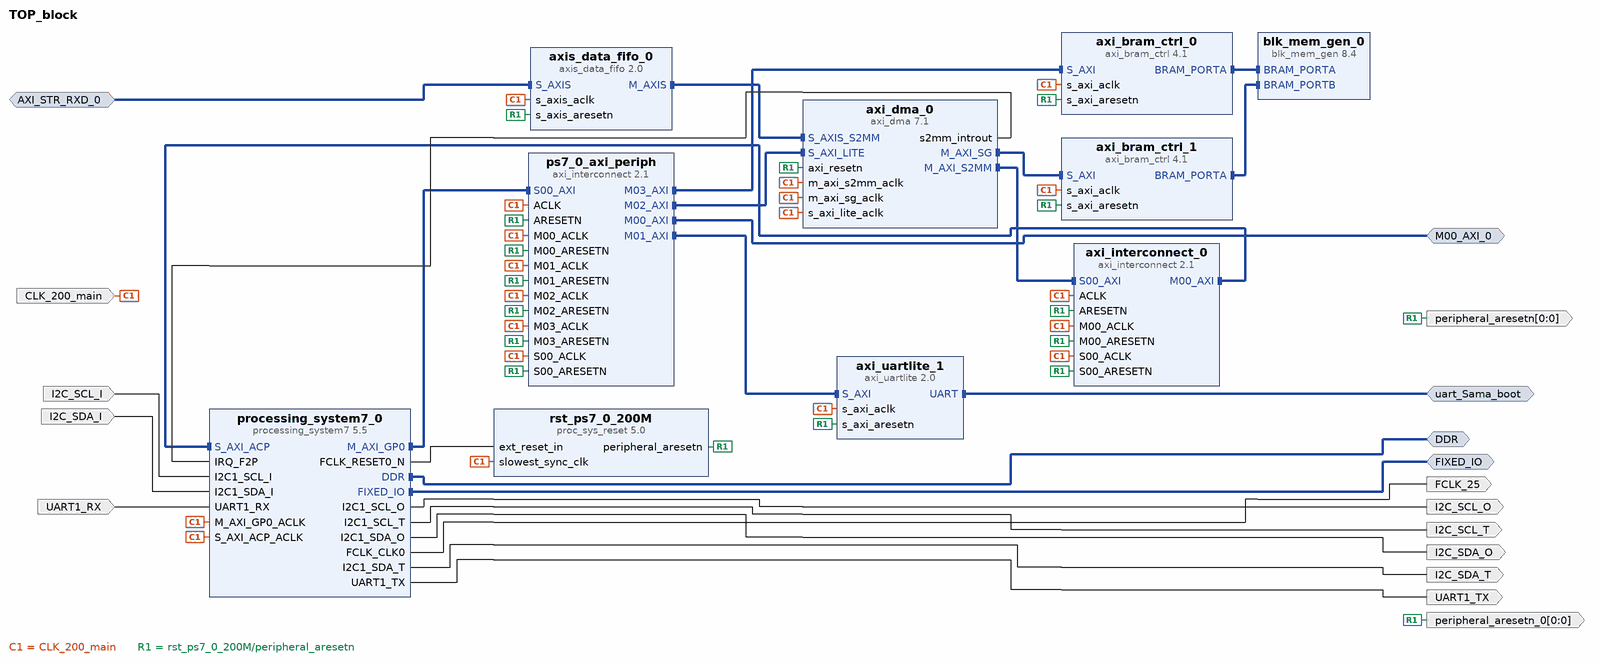
[diagram p0: block diagram of the top level]
# Vivado block design TOP_block, xc7z014sclg484-2, Vivado 2019.2
create_bd_design TOP_block

create_bd_intf_port -mode Master -vlnv xilinx.com:interface:ddrx_rtl:1.0 DDR
create_bd_intf_port -mode Master -vlnv xilinx.com:display_processing_system7:fixedio_rtl:1.0 FIXED_IO
create_bd_intf_port -mode Slave -vlnv xilinx.com:interface:axis_rtl:1.0 AXI_STR_RXD_0
set_property -dict [list \
  CONFIG.TDATA_NUM_BYTES 4 \
  CONFIG.TDEST_WIDTH 0 \
  CONFIG.TID_WIDTH 0 \
  CONFIG.TUSER_WIDTH 0 \
  CONFIG.HAS_TREADY 1 \
  CONFIG.HAS_TSTRB 0 \
  CONFIG.HAS_TKEEP 0 \
  CONFIG.HAS_TLAST 1 \
  CONFIG.FREQ_HZ 200000000 \
  CONFIG.LAYERED_METADATA undef \
] [get_bd_intf_ports AXI_STR_RXD_0]
create_bd_intf_port -mode Master -vlnv xilinx.com:interface:uart_rtl:1.0 uart_Sama_boot
create_bd_intf_port -mode Master -vlnv xilinx.com:interface:aximm_rtl:1.0 M00_AXI_0
set_property -dict [list \
  CONFIG.DATA_WIDTH 32 \
  CONFIG.PROTOCOL AXI4LITE \
  CONFIG.FREQ_HZ 200000000 \
  CONFIG.ADDR_WIDTH 32 \
  CONFIG.HAS_BURST 0 \
  CONFIG.HAS_LOCK 0 \
  CONFIG.HAS_CACHE 0 \
  CONFIG.HAS_QOS 0 \
  CONFIG.HAS_REGION 0 \
  CONFIG.NUM_READ_OUTSTANDING 2 \
  CONFIG.NUM_WRITE_OUTSTANDING 2 \
] [get_bd_intf_ports M00_AXI_0]
create_bd_port -dir O UART1_TX
create_bd_port -dir I UART1_RX
create_bd_port -dir I I2C_SDA_I
create_bd_port -dir O I2C_SDA_O
create_bd_port -dir O I2C_SDA_T
create_bd_port -dir I I2C_SCL_I
create_bd_port -dir O I2C_SCL_O
create_bd_port -dir O I2C_SCL_T
create_bd_port -dir O -type clk FCLK_25
set_property -dict {CONFIG.FREQ_HZ 25000000} [get_bd_ports FCLK_25]
create_bd_port -dir I -type clk CLK_200_main
set_property -dict {CONFIG.FREQ_HZ 200000000} [get_bd_ports CLK_200_main]
create_bd_port -dir O -from 0 -to 0 -type rst peripheral_aresetn
create_bd_port -dir O -from 0 -to 0 -type rst peripheral_aresetn_0

create_bd_cell -type ip -vlnv xilinx.com:ip:axi_bram_ctrl:4.1 axi_bram_ctrl_0
set_property -dict {CONFIG.PROTOCOL AXI4 CONFIG.SINGLE_PORT_BRAM 1} [get_bd_cells axi_bram_ctrl_0]
create_bd_cell -type ip -vlnv xilinx.com:ip:axi_bram_ctrl:4.1 axi_bram_ctrl_1
set_property -dict {CONFIG.PROTOCOL AXI4 CONFIG.SINGLE_PORT_BRAM 1} [get_bd_cells axi_bram_ctrl_1]
create_bd_cell -type ip -vlnv xilinx.com:ip:axi_dma:7.1 axi_dma_0
set_property -dict [list \
  CONFIG.c_include_mm2s 0 \
  CONFIG.c_include_s2mm 1 \
  CONFIG.c_include_sg 1 \
  CONFIG.c_s2mm_burst_size 256 \
  CONFIG.c_sg_include_stscntrl_strm 0 \
  CONFIG.c_sg_length_width 24 \
] [get_bd_cells axi_dma_0]
create_bd_cell -type ip -vlnv xilinx.com:ip:axi_interconnect:2.1 axi_interconnect_0
set_property -dict {CONFIG.NUM_MI 1 CONFIG.NUM_SI 1} [get_bd_cells axi_interconnect_0]
create_bd_cell -type ip -vlnv xilinx.com:ip:axi_uartlite:2.0 axi_uartlite_1
set_property -dict {CONFIG.C_BAUDRATE 115200 CONFIG.C_S_AXI_ACLK_FREQ_HZ 200000000} [get_bd_cells axi_uartlite_1]
create_bd_cell -type ip -vlnv xilinx.com:ip:axis_data_fifo:2.0 axis_data_fifo_0
set_property -dict {CONFIG.FIFO_DEPTH 16384 CONFIG.FIFO_MODE 2 CONFIG.IS_ACLK_ASYNC 0} [get_bd_cells axis_data_fifo_0]
create_bd_cell -type ip -vlnv xilinx.com:ip:blk_mem_gen:8.4 blk_mem_gen_0
set_property -dict [list \
  CONFIG.EN_SAFETY_CKT false \
  CONFIG.Enable_B Use_ENB_Pin \
  CONFIG.Memory_Type True_Dual_Port_RAM \
  CONFIG.Port_B_Clock 100 \
  CONFIG.Port_B_Enable_Rate 100 \
  CONFIG.Port_B_Write_Rate 50 \
  CONFIG.Use_RSTB_Pin true \
] [get_bd_cells blk_mem_gen_0]
create_bd_cell -type ip -vlnv xilinx.com:ip:processing_system7:5.5 processing_system7_0
set_property -dict [list \
  CONFIG.PCW_APU_PERIPHERAL_FREQMHZ 650 \
  CONFIG.PCW_CPU_CPU_6X4X_MAX_RANGE 767 \
  CONFIG.PCW_CRYSTAL_PERIPHERAL_FREQMHZ 50 \
  CONFIG.PCW_ENET0_ENET0_IO {MIO 16 .. 27} \
  CONFIG.PCW_ENET0_GRP_MDIO_ENABLE 1 \
  CONFIG.PCW_ENET0_GRP_MDIO_IO {MIO 52 .. 53} \
  CONFIG.PCW_ENET0_PERIPHERAL_ENABLE 1 \
  CONFIG.PCW_FPGA0_PERIPHERAL_FREQMHZ 25 \
  CONFIG.PCW_FPGA1_PERIPHERAL_FREQMHZ 50 \
  CONFIG.PCW_FPGA2_PERIPHERAL_FREQMHZ 25 \
  CONFIG.PCW_GPIO_MIO_GPIO_ENABLE 0 \
  CONFIG.PCW_I2C0_GRP_INT_ENABLE 0 \
  CONFIG.PCW_I2C0_I2C0_IO {MIO 50 .. 51} \
  CONFIG.PCW_I2C0_PERIPHERAL_ENABLE 1 \
  CONFIG.PCW_I2C1_I2C1_IO EMIO \
  CONFIG.PCW_I2C1_PERIPHERAL_ENABLE 1 \
  CONFIG.PCW_I2C_PERIPHERAL_FREQMHZ 108.333336 \
  CONFIG.PCW_IRQ_F2P_INTR 1 \
  CONFIG.PCW_PERIPHERAL_BOARD_PRESET part0 \
  CONFIG.PCW_PRESET_BANK1_VOLTAGE {LVCMOS 1.8V} \
  CONFIG.PCW_QSPI_GRP_SINGLE_SS_ENABLE 1 \
  CONFIG.PCW_QSPI_GRP_SINGLE_SS_IO {MIO 1 .. 6} \
  CONFIG.PCW_QSPI_PERIPHERAL_ENABLE 1 \
  CONFIG.PCW_QSPI_QSPI_IO {MIO 1 .. 6} \
  CONFIG.PCW_SD0_PERIPHERAL_ENABLE 0 \
  CONFIG.PCW_SD1_PERIPHERAL_ENABLE 1 \
  CONFIG.PCW_SD1_SD1_IO {MIO 10 .. 15} \
  CONFIG.PCW_SDIO_PERIPHERAL_FREQMHZ 100 \
  CONFIG.PCW_SINGLE_QSPI_DATA_MODE x4 \
  CONFIG.PCW_UART0_PERIPHERAL_ENABLE 1 \
  CONFIG.PCW_UART0_UART0_IO {MIO 46 .. 47} \
  CONFIG.PCW_UART1_PERIPHERAL_ENABLE 1 \
  CONFIG.PCW_UART1_UART1_IO EMIO \
  CONFIG.PCW_UART_PERIPHERAL_FREQMHZ 100 \
  CONFIG.PCW_UIPARAM_DDR_BUS_WIDTH {16 Bit} \
  CONFIG.PCW_UIPARAM_DDR_FREQ_MHZ 400 \
  CONFIG.PCW_UIPARAM_DDR_MEMORY_TYPE {DDR 3 (Low Voltage)} \
  CONFIG.PCW_UIPARAM_DDR_PARTNO {MT41K256M16 RE-125} \
  CONFIG.PCW_USB0_PERIPHERAL_ENABLE 0 \
  CONFIG.PCW_USE_FABRIC_INTERRUPT 1 \
  CONFIG.PCW_USE_S_AXI_ACP 1 \
] [get_bd_cells processing_system7_0]
# 440 more settings of processing_system7_0 are not shown: defaults, MIO pin electricals, DDR timing, and values the tool derives
create_bd_cell -type ip -vlnv xilinx.com:ip:axi_interconnect:2.1 ps7_0_axi_periph
set_property -dict {CONFIG.NUM_MI 4} [get_bd_cells ps7_0_axi_periph]
create_bd_cell -type ip -vlnv xilinx.com:ip:proc_sys_reset:5.0 rst_ps7_0_200M
set_property -dict {CONFIG.C_NUM_PERP_RST 1} [get_bd_cells rst_ps7_0_200M]

# ---- connections ----

connect_bd_intf_net [get_bd_intf_ports DDR] [get_bd_intf_pins processing_system7_0/DDR]
connect_bd_intf_net [get_bd_intf_pins axi_bram_ctrl_0/BRAM_PORTA] [get_bd_intf_pins blk_mem_gen_0/BRAM_PORTA]
connect_bd_intf_net [get_bd_intf_pins axi_dma_0/M_AXI_SG] [get_bd_intf_pins axi_bram_ctrl_1/S_AXI]
connect_bd_intf_net [get_bd_intf_ports M00_AXI_0] [get_bd_intf_pins ps7_0_axi_periph/M00_AXI]
connect_bd_intf_net [get_bd_intf_pins axi_interconnect_0/M00_AXI] [get_bd_intf_pins processing_system7_0/S_AXI_ACP]
connect_bd_intf_net [get_bd_intf_pins axi_dma_0/M_AXI_S2MM] [get_bd_intf_pins axi_interconnect_0/S00_AXI]
connect_bd_intf_net [get_bd_intf_ports uart_Sama_boot] [get_bd_intf_pins axi_uartlite_1/UART]
connect_bd_intf_net -intf_net AXI_STR_RXD_0_1 [get_bd_intf_ports AXI_STR_RXD_0] [get_bd_intf_pins axis_data_fifo_0/S_AXIS]
connect_bd_intf_net [get_bd_intf_pins ps7_0_axi_periph/M03_AXI] [get_bd_intf_pins axi_bram_ctrl_0/S_AXI]
connect_bd_intf_net [get_bd_intf_ports FIXED_IO] [get_bd_intf_pins processing_system7_0/FIXED_IO]
connect_bd_intf_net [get_bd_intf_pins ps7_0_axi_periph/M02_AXI] [get_bd_intf_pins axi_dma_0/S_AXI_LITE]
connect_bd_intf_net [get_bd_intf_pins axis_data_fifo_0/M_AXIS] [get_bd_intf_pins axi_dma_0/S_AXIS_S2MM]
connect_bd_intf_net [get_bd_intf_pins processing_system7_0/M_AXI_GP0] [get_bd_intf_pins ps7_0_axi_periph/S00_AXI]
connect_bd_intf_net [get_bd_intf_pins blk_mem_gen_0/BRAM_PORTB] [get_bd_intf_pins axi_bram_ctrl_1/BRAM_PORTA]
connect_bd_intf_net [get_bd_intf_pins ps7_0_axi_periph/M01_AXI] [get_bd_intf_pins axi_uartlite_1/S_AXI]
connect_bd_net [get_bd_ports CLK_200_main] \
  [get_bd_pins axi_bram_ctrl_0/s_axi_aclk] [get_bd_pins axi_bram_ctrl_1/s_axi_aclk] [get_bd_pins axi_dma_0/s_axi_lite_aclk] \
  [get_bd_pins axi_dma_0/m_axi_sg_aclk] [get_bd_pins axi_dma_0/m_axi_s2mm_aclk] [get_bd_pins axi_interconnect_0/ACLK] \
  [get_bd_pins axi_interconnect_0/S00_ACLK] [get_bd_pins axi_interconnect_0/M00_ACLK] [get_bd_pins axi_uartlite_1/s_axi_aclk] \
  [get_bd_pins axis_data_fifo_0/s_axis_aclk] [get_bd_pins processing_system7_0/M_AXI_GP0_ACLK] \
  [get_bd_pins processing_system7_0/S_AXI_ACP_ACLK] [get_bd_pins ps7_0_axi_periph/ACLK] \
  [get_bd_pins ps7_0_axi_periph/S00_ACLK] [get_bd_pins ps7_0_axi_periph/M00_ACLK] [get_bd_pins ps7_0_axi_periph/M01_ACLK] \
  [get_bd_pins ps7_0_axi_periph/M02_ACLK] [get_bd_pins ps7_0_axi_periph/M03_ACLK] \
  [get_bd_pins rst_ps7_0_200M/slowest_sync_clk]
connect_bd_net [get_bd_ports I2C_SCL_I] [get_bd_pins processing_system7_0/I2C1_SCL_I]
connect_bd_net [get_bd_ports I2C_SDA_I] [get_bd_pins processing_system7_0/I2C1_SDA_I]
connect_bd_net [get_bd_ports UART1_RX] [get_bd_pins processing_system7_0/UART1_RX]
connect_bd_net [get_bd_pins axi_dma_0/s2mm_introut] [get_bd_pins processing_system7_0/IRQ_F2P]
connect_bd_net [get_bd_pins processing_system7_0/FCLK_RESET0_N] [get_bd_pins rst_ps7_0_200M/ext_reset_in]
connect_bd_net [get_bd_pins processing_system7_0/I2C1_SCL_O] [get_bd_ports I2C_SCL_O]
connect_bd_net [get_bd_pins processing_system7_0/I2C1_SCL_T] [get_bd_ports I2C_SCL_T]
connect_bd_net [get_bd_pins processing_system7_0/I2C1_SDA_O] [get_bd_ports I2C_SDA_O]
connect_bd_net [get_bd_pins processing_system7_0/I2C1_SDA_T] [get_bd_ports I2C_SDA_T]
connect_bd_net [get_bd_pins processing_system7_0/UART1_TX] [get_bd_ports UART1_TX]
connect_bd_net [get_bd_pins rst_ps7_0_200M/peripheral_aresetn] \
  [get_bd_ports peripheral_aresetn_0] [get_bd_ports peripheral_aresetn] [get_bd_pins axi_bram_ctrl_0/s_axi_aresetn] \
  [get_bd_pins axi_bram_ctrl_1/s_axi_aresetn] [get_bd_pins axi_dma_0/axi_resetn] [get_bd_pins axi_interconnect_0/ARESETN] \
  [get_bd_pins axi_interconnect_0/S00_ARESETN] [get_bd_pins axi_interconnect_0/M00_ARESETN] \
  [get_bd_pins axi_uartlite_1/s_axi_aresetn] [get_bd_pins axis_data_fifo_0/s_axis_aresetn] \
  [get_bd_pins ps7_0_axi_periph/ARESETN] [get_bd_pins ps7_0_axi_periph/S00_ARESETN] \
  [get_bd_pins ps7_0_axi_periph/M00_ARESETN] [get_bd_pins ps7_0_axi_periph/M01_ARESETN] \
  [get_bd_pins ps7_0_axi_periph/M02_ARESETN] [get_bd_pins ps7_0_axi_periph/M03_ARESETN]
connect_bd_net [get_bd_pins processing_system7_0/FCLK_CLK0] [get_bd_ports FCLK_25]
set_property HDL_ATTRIBUTE.BMM_INFO_ADDRESS_SPACE {byte  0x40000000 32 > TOP_block blk_mem_gen_0} [get_bd_cells axi_bram_ctrl_0]
set_property HDL_ATTRIBUTE.KEEP_HIERARCHY yes [get_bd_cells axi_bram_ctrl_0]
set_property HDL_ATTRIBUTE.BMM_INFO_PROCESSOR {arm > TOP_block axi_bram_ctrl_0} [get_bd_cells processing_system7_0]
set_property HDL_ATTRIBUTE.KEEP_HIERARCHY yes [get_bd_cells processing_system7_0]

# ---- address map ----
assign_bd_address -offset 0x00000000 -range 512M -target_address_space [get_bd_addr_spaces axi_dma_0/Data_S2MM] [get_bd_addr_segs processing_system7_0/S_AXI_ACP/ACP_DDR_LOWOCM]
assign_bd_address -offset 0xFC000000 -range 16M -target_address_space [get_bd_addr_spaces axi_dma_0/Data_S2MM] [get_bd_addr_segs processing_system7_0/S_AXI_ACP/ACP_QSPI_LINEAR]
assign_bd_address -offset 0x40000000 -range 8K -target_address_space [get_bd_addr_spaces axi_dma_0/Data_SG] [get_bd_addr_segs axi_bram_ctrl_1/S_AXI/Mem0]
assign_bd_address -offset 0x40000000 -range 8K -target_address_space [get_bd_addr_spaces processing_system7_0/Data] [get_bd_addr_segs axi_bram_ctrl_0/S_AXI/Mem0]
assign_bd_address -offset 0x40400000 -range 64K -target_address_space [get_bd_addr_spaces processing_system7_0/Data] [get_bd_addr_segs axi_dma_0/S_AXI_LITE/Reg]
assign_bd_address -offset 0x42C10000 -range 64K -target_address_space [get_bd_addr_spaces processing_system7_0/Data] [get_bd_addr_segs axi_uartlite_1/S_AXI/Reg]
assign_bd_address -offset 0x43D00000 -range 64K -target_address_space [get_bd_addr_spaces processing_system7_0/Data] [get_bd_addr_segs M00_AXI_0/Reg]

validate_bd_design
save_bd_design
